# Altium schematic sheet Potencia.SchDoc: GRUPO ALTECH
size A3; DocumentNumber: GA0070; SheetNumber: 4; SheetTotal: 4
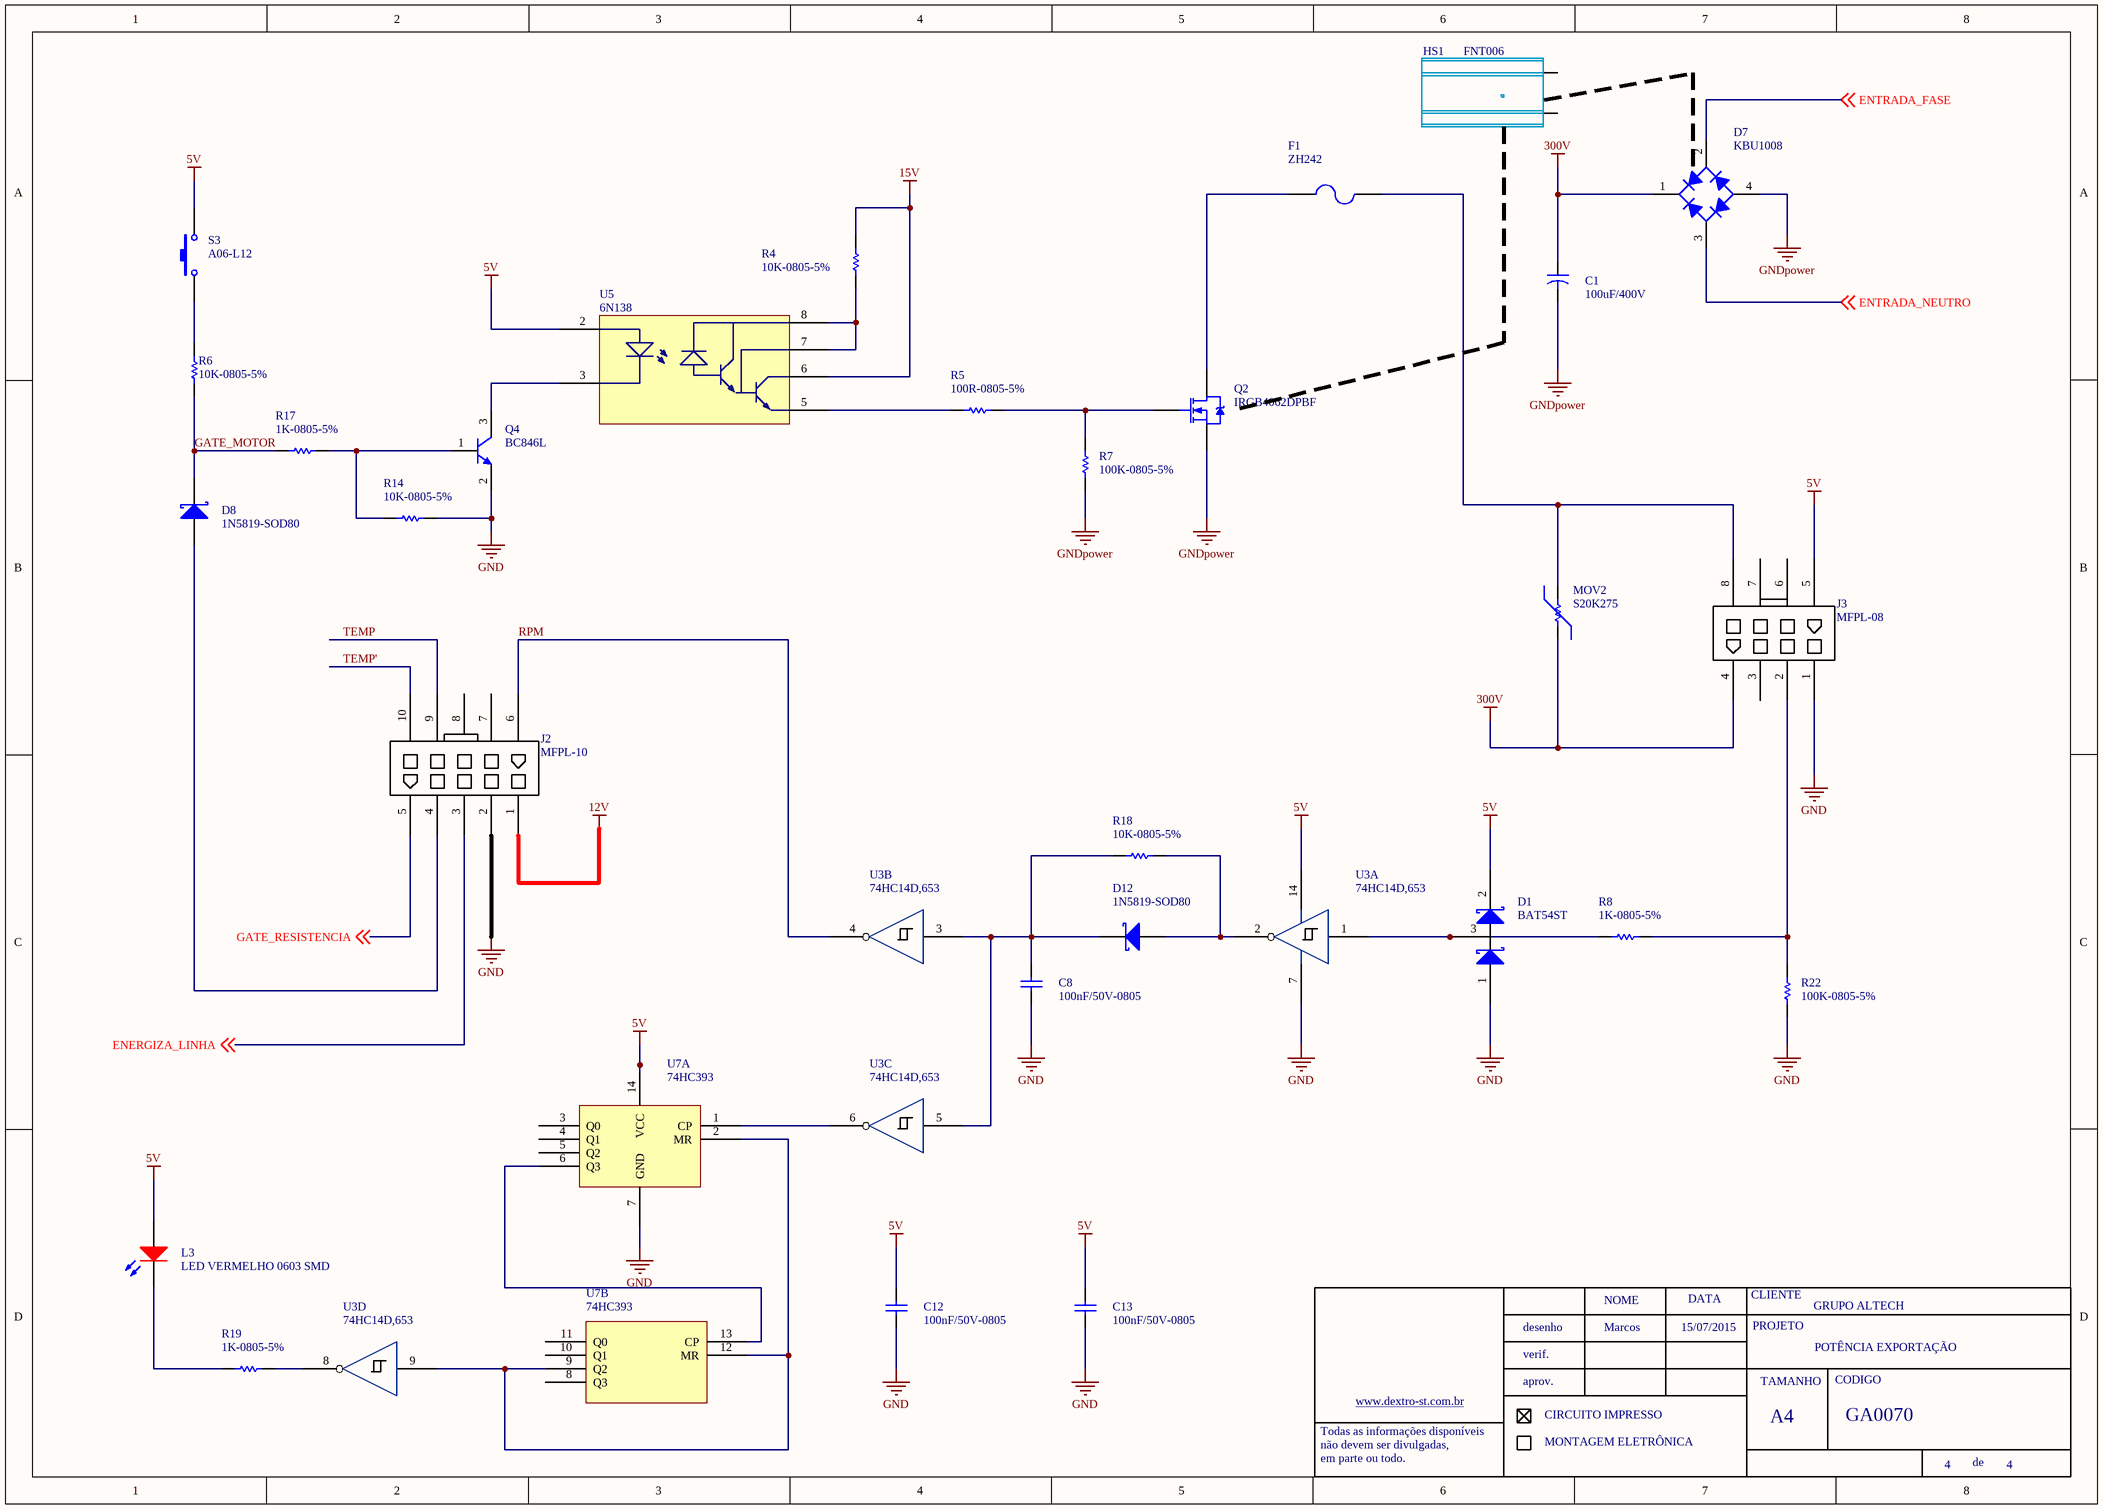
[diagram p0: Potencia.SchDoc]

## Parts
C1  100uF/400V  [CAP 470UF/400V HITANO]
C8  100nF/50V-0805  [0805-REVISADO ONDA]
C12  100nF/50V-0805  [0805-REVISADO ONDA]
C13  100nF/50V-0805  [0805-REVISADO ONDA]
D1  BAT54ST  [SOT23 - REVISADO ONDA]
D7  KBU1008  [KBU-810]
D8  1N5819-SOD80  [MINIMLEF/SOD80 - REVISADO ONDA]
D12  1N5819-SOD80  [MINIMLEF/SOD80 - REVISADO ONDA]
F1  ZH242  [ZH242_REVISADO]
HS1  FNT006  [dissipador grande]
J2  MFPL-10  [MFPC-10]
J3  MFPL-08  [MFPC-08]
L3  LED VERMELHO 0603 SMD  [LED 1206]
MOV2  S20K275  [VARISTOR 20mm]
Q2  IRGB4062DPBF  [TO220-3 EM PÉ]
Q4  BC846L  [SOT23 - REVISADO ONDA]
R4  10K-0805-5%  [0805-REVISADO ONDA]
R5  100R-0805-5%  [0805-REVISADO ONDA]
R6  10K-0805-5%  [0805-REVISADO ONDA]
R7  100K-0805-5%  [0805-REVISADO ONDA]
R8  1K-0805-5%  [0805-REVISADO ONDA]
R14  10K-0805-5%  [0805-REVISADO ONDA]
R17  1K-0805-5%  [0805-REVISADO ONDA]
R18  10K-0805-5%  [0805-REVISADO ONDA]
R19  1K-0805-5%  [0805-REVISADO ONDA]
R22  100K-0805-5%  [0805-REVISADO ONDA]
S3  A06-L12  [CHAVE_A06]
U3  74HC14D,653  [SOIC 14 PINOS]  (parts A,B,C,D of 6)
U5  6N138  [DIP-8]
U7  74HC393  [SOIC 14 PINOS]  (parts A,B of 2)

## Nets
5V: C12.2 C13.2 D1.2 J3.5 L3.1(A) S3.2 U3.14(VCC) U5.2(A) U7.14(VCC)
12V: J2.1
15V: R4.2 U5.6
300V: C1.1 D7.1(K) J3.4 MOV2.2
GND: C8.1 C12.1 C13.1 D1.1 J2.2 J3.1 Q4.2(E) R14.2 R22.1 U3.7(GND) U7.7(GND)
GNDpower: C1.2 D7.4(A) Q2.3(S) R7.1
ENERGIZA_LINHA: J2.3 ; off-sheet ENERGIZA_LINHA
ENTRADA_FASE: D7.2(C) ; off-sheet ENTRADA_FASE
ENTRADA_NEUTRO: D7.3(C) ; off-sheet ENTRADA_NEUTRO
GATE_MOTOR: D8.2(K) R6.2 R17.1
GATE_RESISTENCIA: J2.5 ; off-sheet GATE_RESISTENCIA
RPM: J2.6 U3.4
TEMP: J2.9
TEMP': J2.10
NetC8_2: C8.2 D12.2(K) R18.1 U3.3 U3.5
NetD1_3: D1.3 R8.1 U3.1
NetD8_1: D8.1(A) J2.4
NetD12_1: D12.1(A) R18.2 U3.2
NetF1_1: F1.1 J3.8 MOV2.1
NetF1_2: F1.2 Q2.2(D)
NetJ3_2: J3.2 R8.2 R22.2
NetL3_2: L3.2(K) R19.2
NetQ2_1: Q2.1(G) R5.2 R7.2
NetQ4_1: Q4.1(B) R14.1 R17.2
NetQ4_3: Q4.3(C) U5.3(K)
NetR4_1: R4.1 U5.7 U5.8
NetR5_1: R5.1 U5.5(GND)
NetR6_1: R6.1 S3.1
NetR19_1: R19.1 U3.8
NetU3_6: U3.6 U7.1(CP)
NetU3_9: U3.9 U7.2(MR) U7.9(Q2) U7.12(MR)
NetU7_6: U7.6(Q3) U7.13(CP)

Not connected (* = marked no-connect by the designer): HS1 0 1; J2 7 8; J3 3 6 7; U7 3(Q0) 4(Q1) 5(Q2) 8(Q3) 10(Q1) 11(Q0)

## Notes on the sheet
- Marcos
- 15/07/2015
- POTÊNCIA EXPORTAÇÃO
- NOME
- DATA
- CLIENTE
- PROJETO
- desenho
- verif.
- aprov.
- TAMANHO
- CODIGO
- Todas as informações disponíveis
- não devem ser divulgadas,
- em parte ou todo.
- www.dextro-st.com.br
- CIRCUITO IMPRESSO
- MONTAGEM ELETRÔNICA
- A4
- de

## Library data of the parts
C1 = 100uF/50V: ERP: 105.01.003
C8 C12 C13 = 100nF/50-0805-NPO: ERP: 104.11.005
D7 = KBU 1008: ERP: 170.01.001
F1 = PORTA FUSÍVEL TIPO BERÇO: ERP: 426.00.002
HS1 = DISSIPADOR 40mm PÉ
Q2 = IRF740: ERP: 107.01.021
Q4 = BC846: ERP: 106.22.001
R4 = 100R-0805-5%: ERP: 102.11.031
R17 = 10K-0805-5%: ERP: 102.11.054
U3 = 74HC14D
U5 = 6N138: ERP: FALTA CADASTRAR
D8 D12 = 1N5819-SOD80: ERP: 121.18.003
L3 = LED VERMELHO 0603 SMD: ERP: 124.02.010
R5 = 100R-0805-5%: ERP: 102.11.031
R6 R14 R18 = 10K-0805-5%: ERP: 102.11.054
R7 R22 = 100K-0805-5%: ERP: 102.11.066
R8 R19 = 1K-0805-5%: ERP: 102.11.042
S3 = A06-L12: ERP: 136.00.001